# EAGLE design Filter_Circuit (EAGLE 7.5.0)
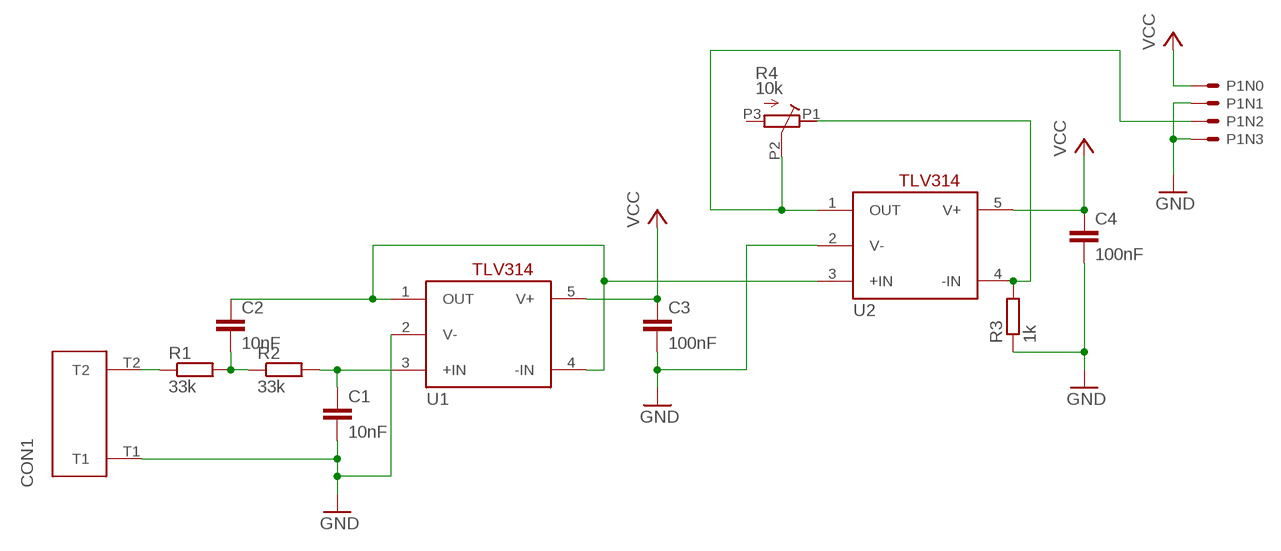
[diagram p0: schematic, sheet 1]

## Parts
C1  10nF  C-EUC1206  [C1206]
C2  10nF  C-EUC1206  [C1206]
C3  100nF  C-EUC1206  [C1206]
C4  100nF  C-EUC1206  [C1206]
CON1  2PIN_SCREW_TERM  [2PIN_SCREW_TERM]
P1  4PINHEADER  [4PINHEADER]
R1  33k  R-EU_R1206  [R1206]
R2  33k  R-EU_R1206  [R1206]
R3  1k  R-EU_R1206  [R1206]
R4  10k  POT_RESISTOR_SMD  [POT_RESISTOR_SMD]
U1  TLV314_OP_AMP  [SOT23]
U2  TLV314_OP_AMP  [SOT23]

## Nets
GND: C1.2 C3.2 C4.2 CON1.T1 P1.N1 P1.N3 R3.1 U1.2(V-) U2.2(V-)
N$1: CON1.T2 R1.1
N$2: C2.2 R1.2 R2.1
N$3: C1.1 R2.2 U1.3(+IN)
N$4: C2.1 U1.1(OUT) U1.4(-IN) U2.3(+IN)
N$10: R3.2 R4.P1 U2.4(-IN)
N$11: P1.N2 R4.P2 U2.1(OUT)
VCC: C3.1 C4.1 P1.N0 U1.5(V+) U2.5(V+)
Unconnected: R4.P3

## Library data of the parts
C1-C4 = rcl:C-EU: CAPACITOR, European symbol
CON1 = ForceTronics:2PIN_SCREW_TERM: 2 pin screw terminal 5mm pin spacing 10mm length 8mm depth
P1 = ForceTronics:4PINHEADER
R1-R3 = rcl:R-EU_: RESISTOR, European symbol
R4 = ForceTronics:POT_RESISTOR_SMD: Surface mount 10k trim / pot resistor. Got it from Aliexpress, name is "SMD Patch Adjutable Potentiometer Resistor"
U1 U2 = ForceTronics:TLV314_OP_AMP: TLV314IDBVT Op Amp from TI. IC OP AMP RRIO 3MHZ SOT-23

## Board
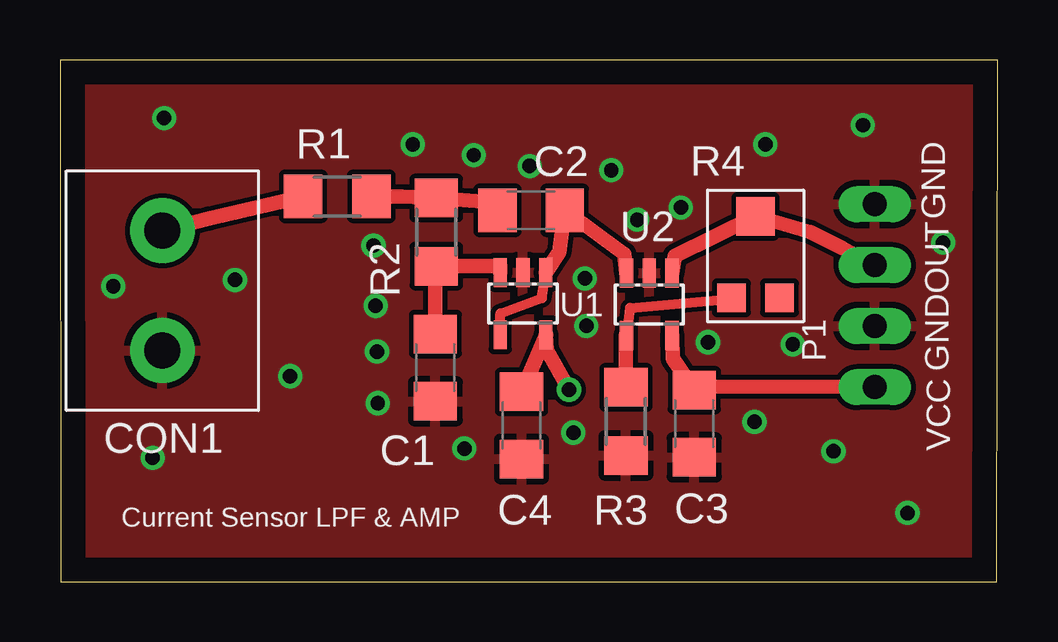
[diagram p1: board, top side]
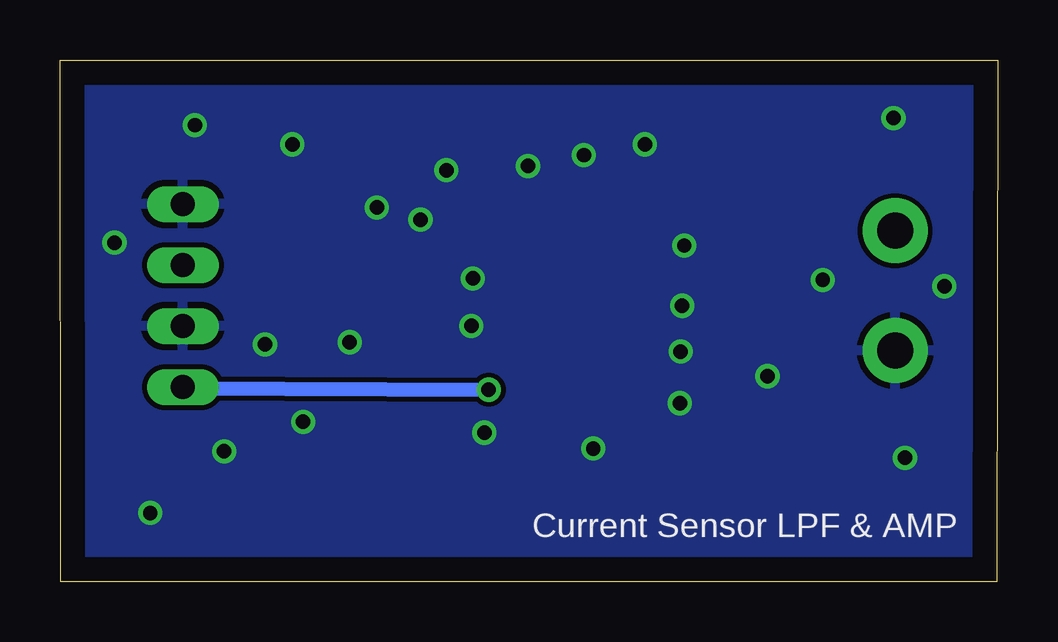
[diagram p2: board, bottom side, seen from below]

Size 39.07 x 21.76 mm. Coordinates in mm from the lower left corner, seen from the top.
Outline: 0.04,0 39.04,0 39.07,21.75 0,21.76 0.04,0
Copper layers (1*16): Top 0.035mm / dielectric 1.5mm / Bottom 0.035mm
Design rules "default": minimum track width 10mil, minimum drill 24mil, track to track 8mil, track to pad 8mil, pad to pad 8mil, via to via 8mil, smd to smd 8mil, copper to edge 40mil, drill to drill 8mil, minimum pad ring 10mil, minimum via ring 8mil, stop-mask expansion 4mil, vias tented up to drill 0mil, thermal gap 10mil

### Footprints (pad centres in the part's own frame; a part is rotated, then mirrored left to right if it is on the bottom)
C1206 = smd 1.6 x 1.8: 1 -1.4,0; 2 1.4,0
2PIN_SCREW_TERM = drill 1.5 pad 2.7: T1 2.5,4; T2 7.5,4
4PINHEADER = drill 1 long: N0 -3.81,0; N1 -1.27,0; N2 1.27,0; N3 3.81,0
R1206 = smd 1.6 x 1.803: 1 -1.422,0; 2 1.422,0
POT_RESISTOR_SMD = smd 1.2 x 1.2: P1 0,0; P3 2,0 | smd 1.6 x 1.6: P2 1,3.4
SOT23 = smd 0.55 x 1.2: 1 1.59,1.24; 2 2.54,1.24; 3 3.49,1.24; 4 3.49,3.84; 5 1.59,3.84

### Placement (x,y rotation side)
C1  15.64,8.93 270 top
C2  19.63,15.49 180 top
C3  26.43,6.59 270 top
C4  19.23,6.52 270 top
CON1  8.27,7.14 90 top
P1  33.95,11.93 90 top
R1  11.55,16.07 0 top
R2  15.68,14.58 270 top
R3  23.58,6.69 90 top
R4  27.98,11.84 0 top
U1  21.83,14.14 180 top
U2  27.09,14.11 180 top

### Tracks (layer width: path | path; a pad name or v marks a point on that pad's centre or on a via)
GND  (via drill 0.6)
  other vias: 13.06,14.02 19.57,17.34 16.85,5.56 13.15,11.51 13.21,9.6 13.24,7.45 14.7,18.24 4.34,19.34 17.24,17.79 22.97,17.16 24.05,15.1 25.87,15.61 21.87,12.65 21.93,10.67 27,9.99 30.53,9.9 28.94,6.67 21.39,6.22 35.31,2.87 3.86,5.17 29.39,18.24 33.45,19.04 7.29,12.59 36.8,14.14 32.23,5.44 9.59,8.57 2.22,12.32
  pour Bottom: -0.96,23 -0.96,-1 40.04,-1 40.04,23
  pour Top: -0.96,23 -0.96,-1 40.04,-1 40.04,23
N$1
  Top 0.61: CON1.T2 6.2,15.15 R1.1
N$2
  Top 0.61: R1.2 14.23,16.06 R2.1 17.62,15.86 C2.2
N$3
  Top 0.61: U1.3 18.34,13.16 R2.2 15.64,13.16 C1.1
N$4
  Top 0.406: U1.4 18.35,11.19 20.08,11.83 U1.1
  Top 0.61: U1.1 20.81,13.74 C2.1 23.51,13.66 U2.3
N$10
  Top 0.406: 23.58,10.27 U2.4 23.63,10.27 23.75,11.42 27.65,11.78 R4.P1
  Top 0.61: 23.58,10.27 R3.2
N$11
  Top 0.406: R4.P2
  Top 0.61: R4.P2 25.62,13.59 U2.1 | P1.N2 32.59,13.92 31.27,14.59 R4.P2
VCC  (via drill 0.6)
  Top 0.406: U1.5
  Top 0.61: U1.5 C4.1 | P1.N0 26.43,8.15 C3.1 25.53,9.31 U2.5 | U1.5 20.28,9.67 v21.21,8.01
  Bottom 0.61: v21.21,8.01 33.96,8.07 34.11,8.12 P1.N0

### Text on the board
tNames: GND | OUT | GND | VCC | Current Sensor LPF & AMP
bNames: Current Sensor LPF & AMP